# EAGLE schematic Moonwalker (EAGLE 6.3)

## Sheet 1 of 5
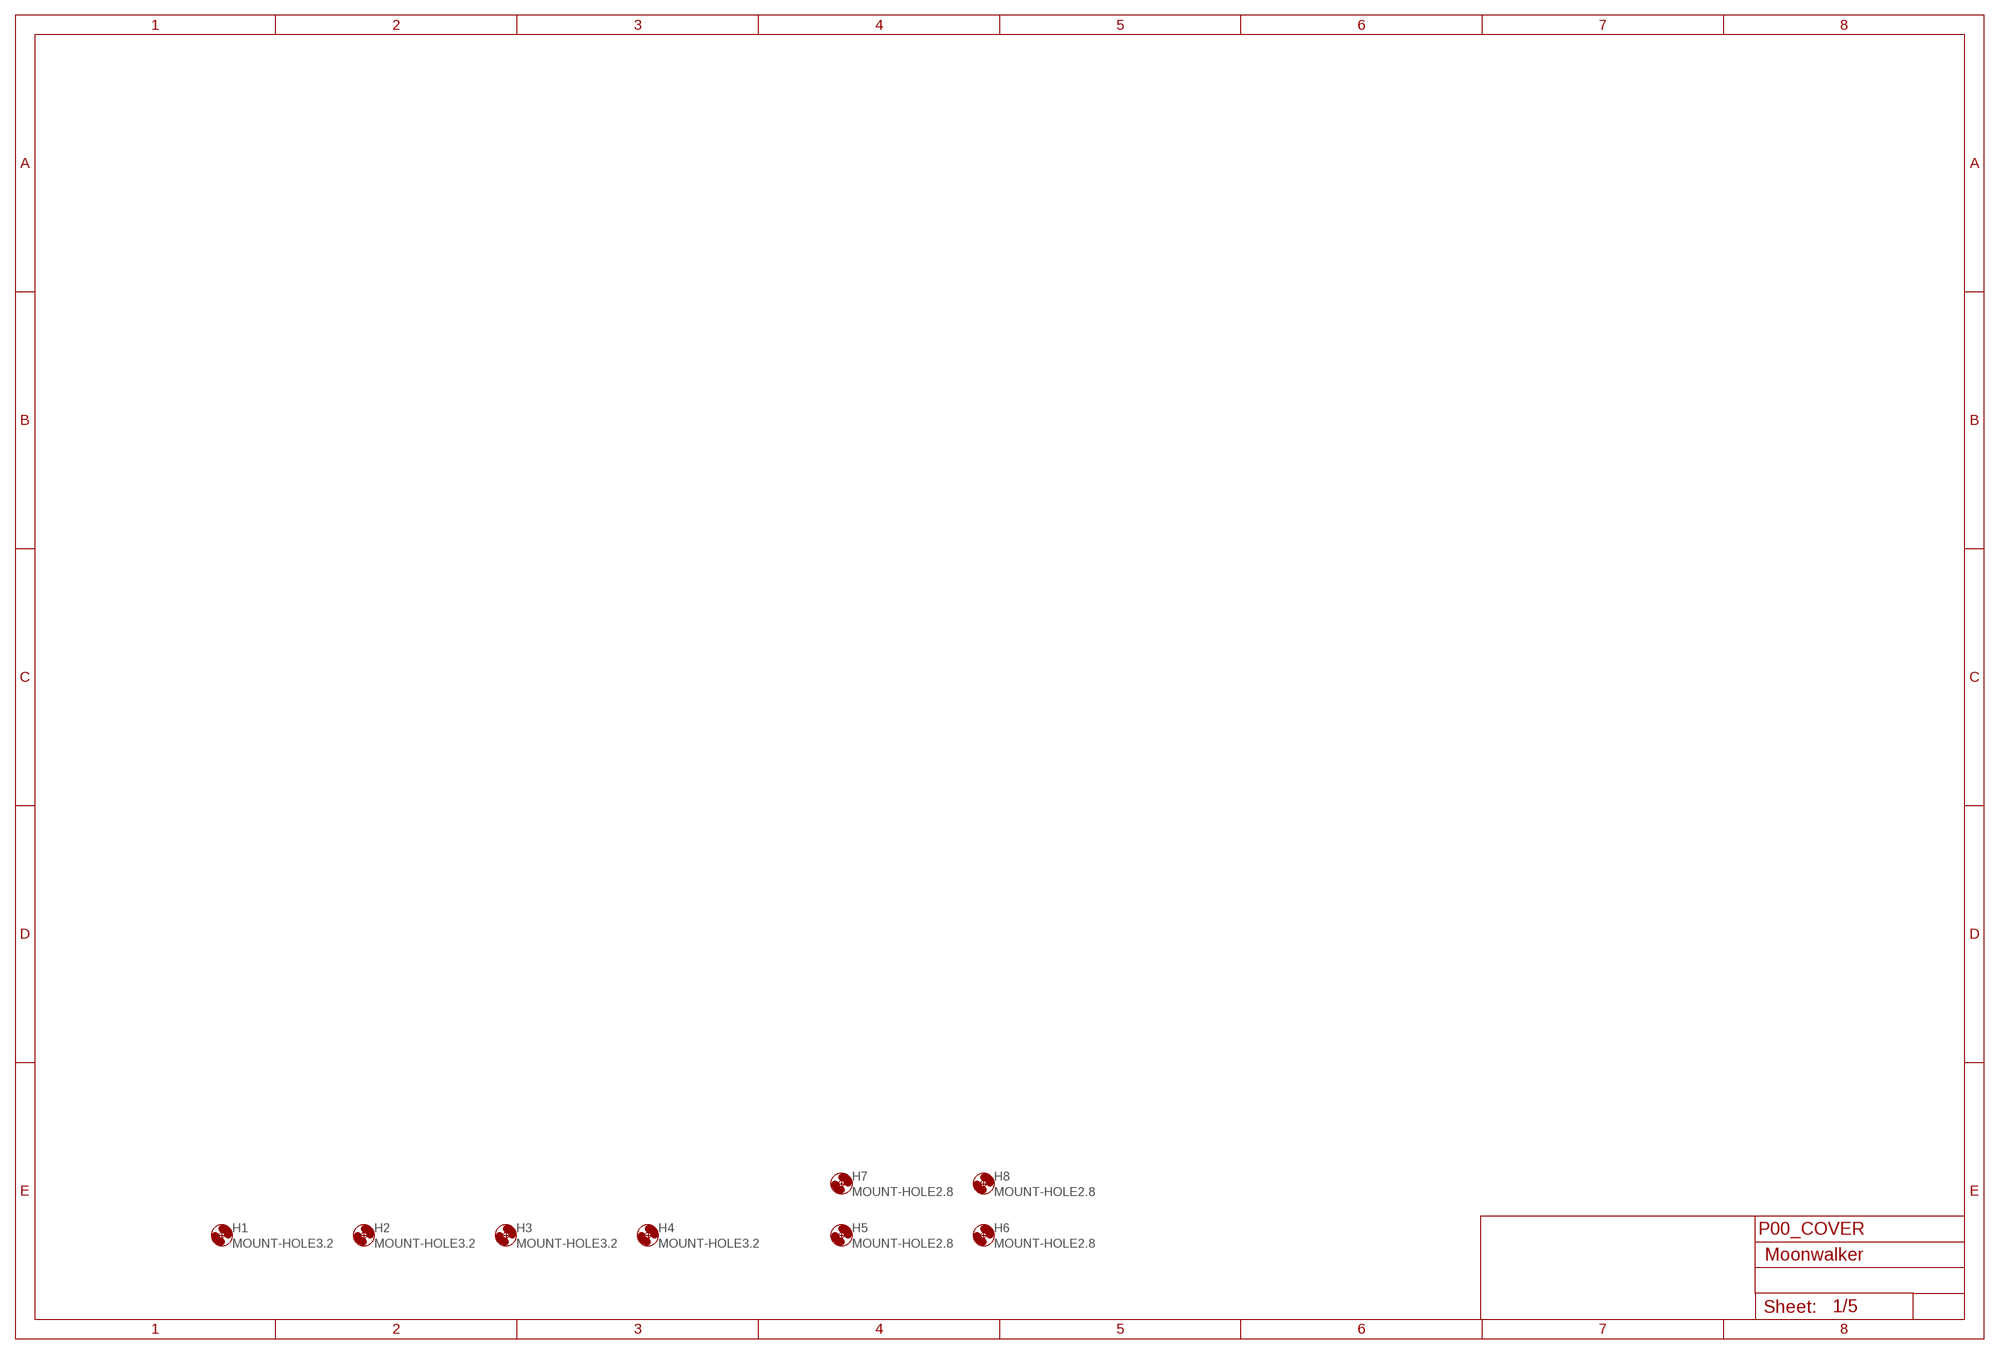
[diagram p0: schematic, sheet 1]

### Parts
H1  MOUNT-HOLE3.2  [3,2]
H2  MOUNT-HOLE3.2  [3,2]
H3  MOUNT-HOLE3.2  [3,2]
H4  MOUNT-HOLE3.2  [3,2]
H5  MOUNT-HOLE2.8  [2,8]
H6  MOUNT-HOLE2.8  [2,8]
H7  MOUNT-HOLE2.8  [2,8]
H8  MOUNT-HOLE2.8  [2,8]

### Notes on the sheet
- P00_COVER

## Sheet 2 of 5
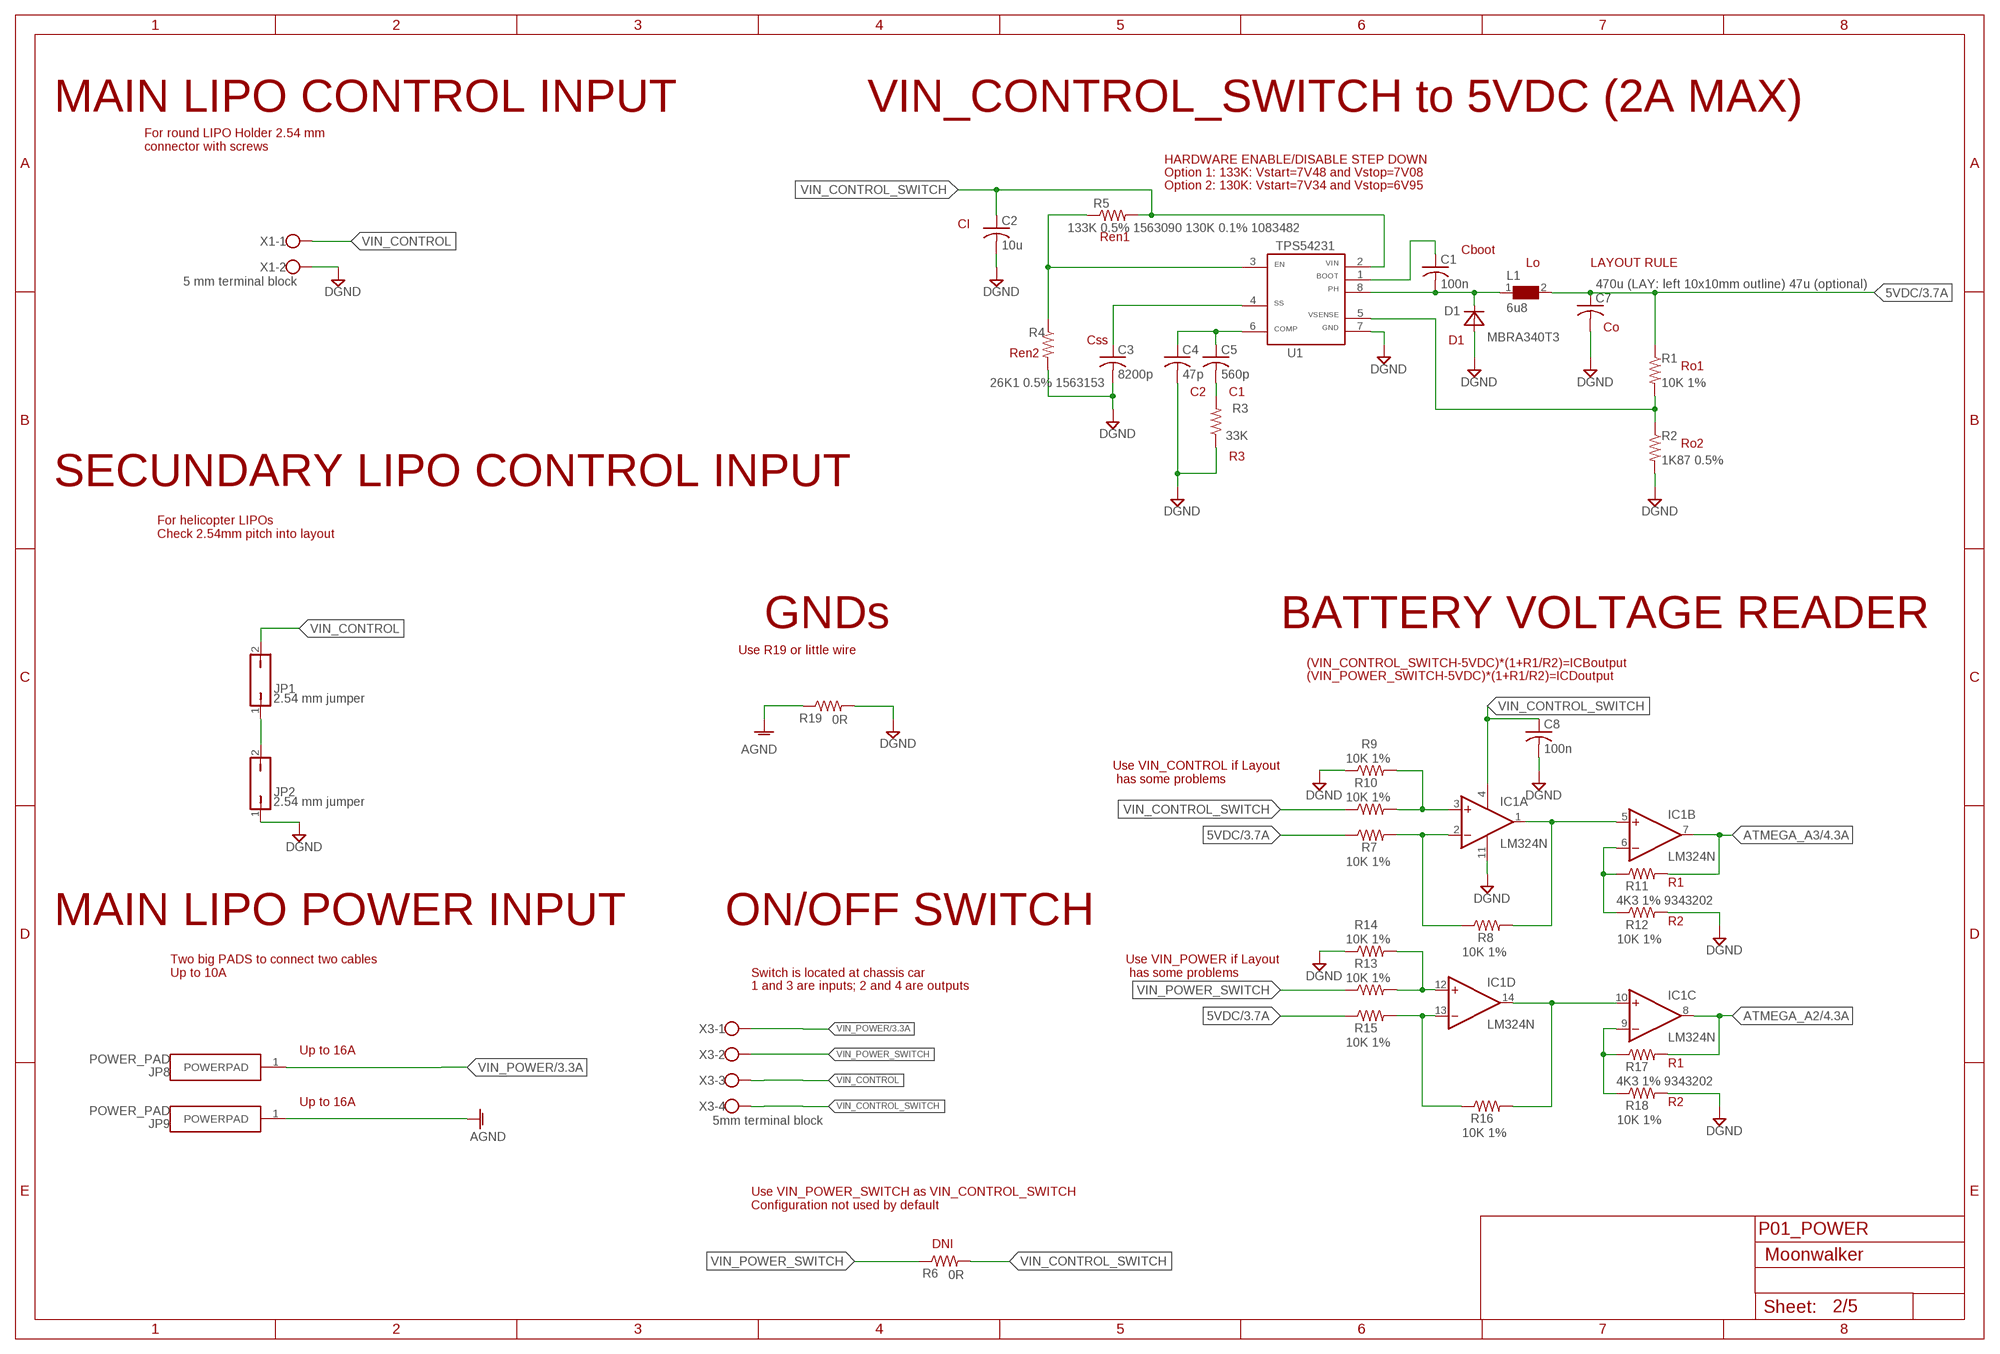
[diagram p1: schematic, sheet 2]

### Parts
C1  100n  C-US075-032X103  [C075-032X103]
C2  10u  C-US025-050X050  [C025-050X050]
C3  8200p  C-USC1206  [C1206]
C4  47p  C-US050-024X044  [C050-024X044]
C5  560p  C-USC1206  [C1206]
C7  470u (LAY: left 10x10mm outline) 47u (optional)  C-US050-075X075  [C050-075X075]
C8  100n  C-US050-024X044  [C050-024X044]
D1  MBRA340T3  [SMA]
IC1  LM324N  [DIL14]
JP1  2.54 mm jumper  JP1Q  [JP1]
JP2  2.54 mm jumper  JP1Q  [JP1]
JP8  POWER_PAD  [POWER_PAD]
JP9  POWER_PAD  [POWER_PAD]
L1  6u8  WE-PD-7447779006_7332/7345_PLASTIC_BASE  [WE-PD_7332/7345_PLASTIC_BASE]
R1  10K 1%  R-US_0309/10  [0309/10]
R2  1K87 0.5%  R-US_0309/10  [0309/10]
R3  33K  R-US_0309/10  [0309/10]
R4  26K1 0.5% 1563153  R-US_0309/10  [0309/10]
R5  133K 0.5% 1563090 130K 0.1% 1083482  R-US_0309/10  [0309/10]
R6  0R  R-US_0309/10  [0309/10]
R7  10K 1%  R-US_0309/10  [0309/10]
R8  10K 1%  R-US_0309/10  [0309/10]
R9  10K 1%  R-US_0309/10  [0309/10]
R10  10K 1%  R-US_0309/10  [0309/10]
R11  4K3 1% 9343202  R-US_0309/10  [0309/10]
R12  10K 1%  R-US_0309/10  [0309/10]
R13  10K 1%  R-US_0309/10  [0309/10]
R14  10K 1%  R-US_0309/10  [0309/10]
R15  10K 1%  R-US_0309/10  [0309/10]
R16  10K 1%  R-US_0309/10  [0309/10]
R17  4K3 1% 9343202  R-US_0309/10  [0309/10]
R18  10K 1%  R-US_0309/10  [0309/10]
R19  0R  R-US_0309/10  [0309/10]
U1  TPS54231SO8  [SO8]
X1  5 mm terminal block  W237-102  [W237-102]
X3  5mm terminal block  W237-4  [W237-4]

### Nets
5VDC: C7.1 L1.2 R1.1 R7.1 R15.1 ; also sheet 3,4,5
AGND: JP9.1(POWERPAD) R19.1 ; also sheet 3
ATMEGA_A2: IC1.8(C:OUT) R17.2 ; also sheet 4
ATMEGA_A3: IC1.7(B:OUT) R11.2 ; also sheet 4
DGND: C2.2 C3.2 C4.2 C7.2 C8.2 D1.A IC1.11(P:V-) JP2.1 R2.2 R3.1 R4.2 R9.1 R12.2 R14.1 R18.2 R19.2 U1.7 X1.2 ; also sheet 3,4,5
N$1: C4.1 C5.1 U1.6
N$2: C5.2 R3.2
N$3: R4.1 R5.1 U1.3
N$4: C3.1 U1.4
N$7: C1.2 D1.C L1.1 U1.8
N$8: C1.1 U1.1
N$9: R1.2 R2.1 U1.5
N$10: JP1.1 JP2.2
N$13: IC1.3(A:+IN) R9.2 R10.2
N$14: IC1.2(A:-IN) R7.2 R8.1
N$15: IC1.12(D:+IN) R13.2 R14.2
N$16: IC1.13(D:-IN) R15.2 R16.1
N$17: IC1.10(C:+IN) IC1.14(D:OUT) R16.2
N$18: IC1.1(A:OUT) IC1.5(B:+IN) R8.2
N$22: IC1.6(B:-IN) R11.1 R12.1
N$24: IC1.9(C:-IN) R17.1 R18.1
VIN_CONTROL: JP1.2 X1.1 X3.3
VIN_CONTROL_SWITCH: C2.1 C8.1 IC1.4(P:V+) R5.2 R6.2 R10.1 U1.2 X3.4
VIN_POWER: JP8.1(POWERPAD) X3.1 ; also sheet 3
VIN_POWER_SWITCH: R6.1 R13.1 X3.2

### Notes on the sheet
- MAIN LIPO CONTROL INPUT | VIN_CONTROL_SWITCH to 5VDC (2A MAX)
- For round LIPO Holder 2.54 mm 
  connector with screws
- HARDWARE ENABLE/DISABLE STEP DOWN
- Option 1: 133K: Vstart=7V48 and Vstop=7V08
- Option 2: 130K: Vstart=7V34 and Vstop=6V95
- CI
- Ren1
- Cboot
- Lo | LAYOUT RULE
- Co
- Css | D1
- Ren2
- Ro1
- C2 | C1
- Ro2
- R3
- SECUNDARY LIPO CONTROL INPUT
- For helicopter LIPOs
  Check 2.54mm pitch into layout
- GNDs | BATTERY VOLTAGE READER
- Use R19 or little wire
- (VIN_CONTROL_SWITCH-5VDC)*(1+R1/R2)=ICBoutput
- (VIN_POWER_SWITCH-5VDC)*(1+R1/R2)=ICDoutput
- Use VIN_CONTROL if Layout
   has some problems
- R1
- MAIN LIPO POWER INPUT | ON/OFF SWITCH | R2
- Two big PADS to connect two cables
  Up to 10A
- Switch is located at chassis car
- Use VIN_POWER if Layout
   has some problems
- 1 and 3 are inputs; 2 and 4 are outputs
- Up to 16A
- R1
- Up to 16A | R2
- Use VIN_POWER_SWITCH as VIN_CONTROL_SWITCH
  Configuration not used by default
- P01_POWER
- DNI

## Sheet 3 of 5
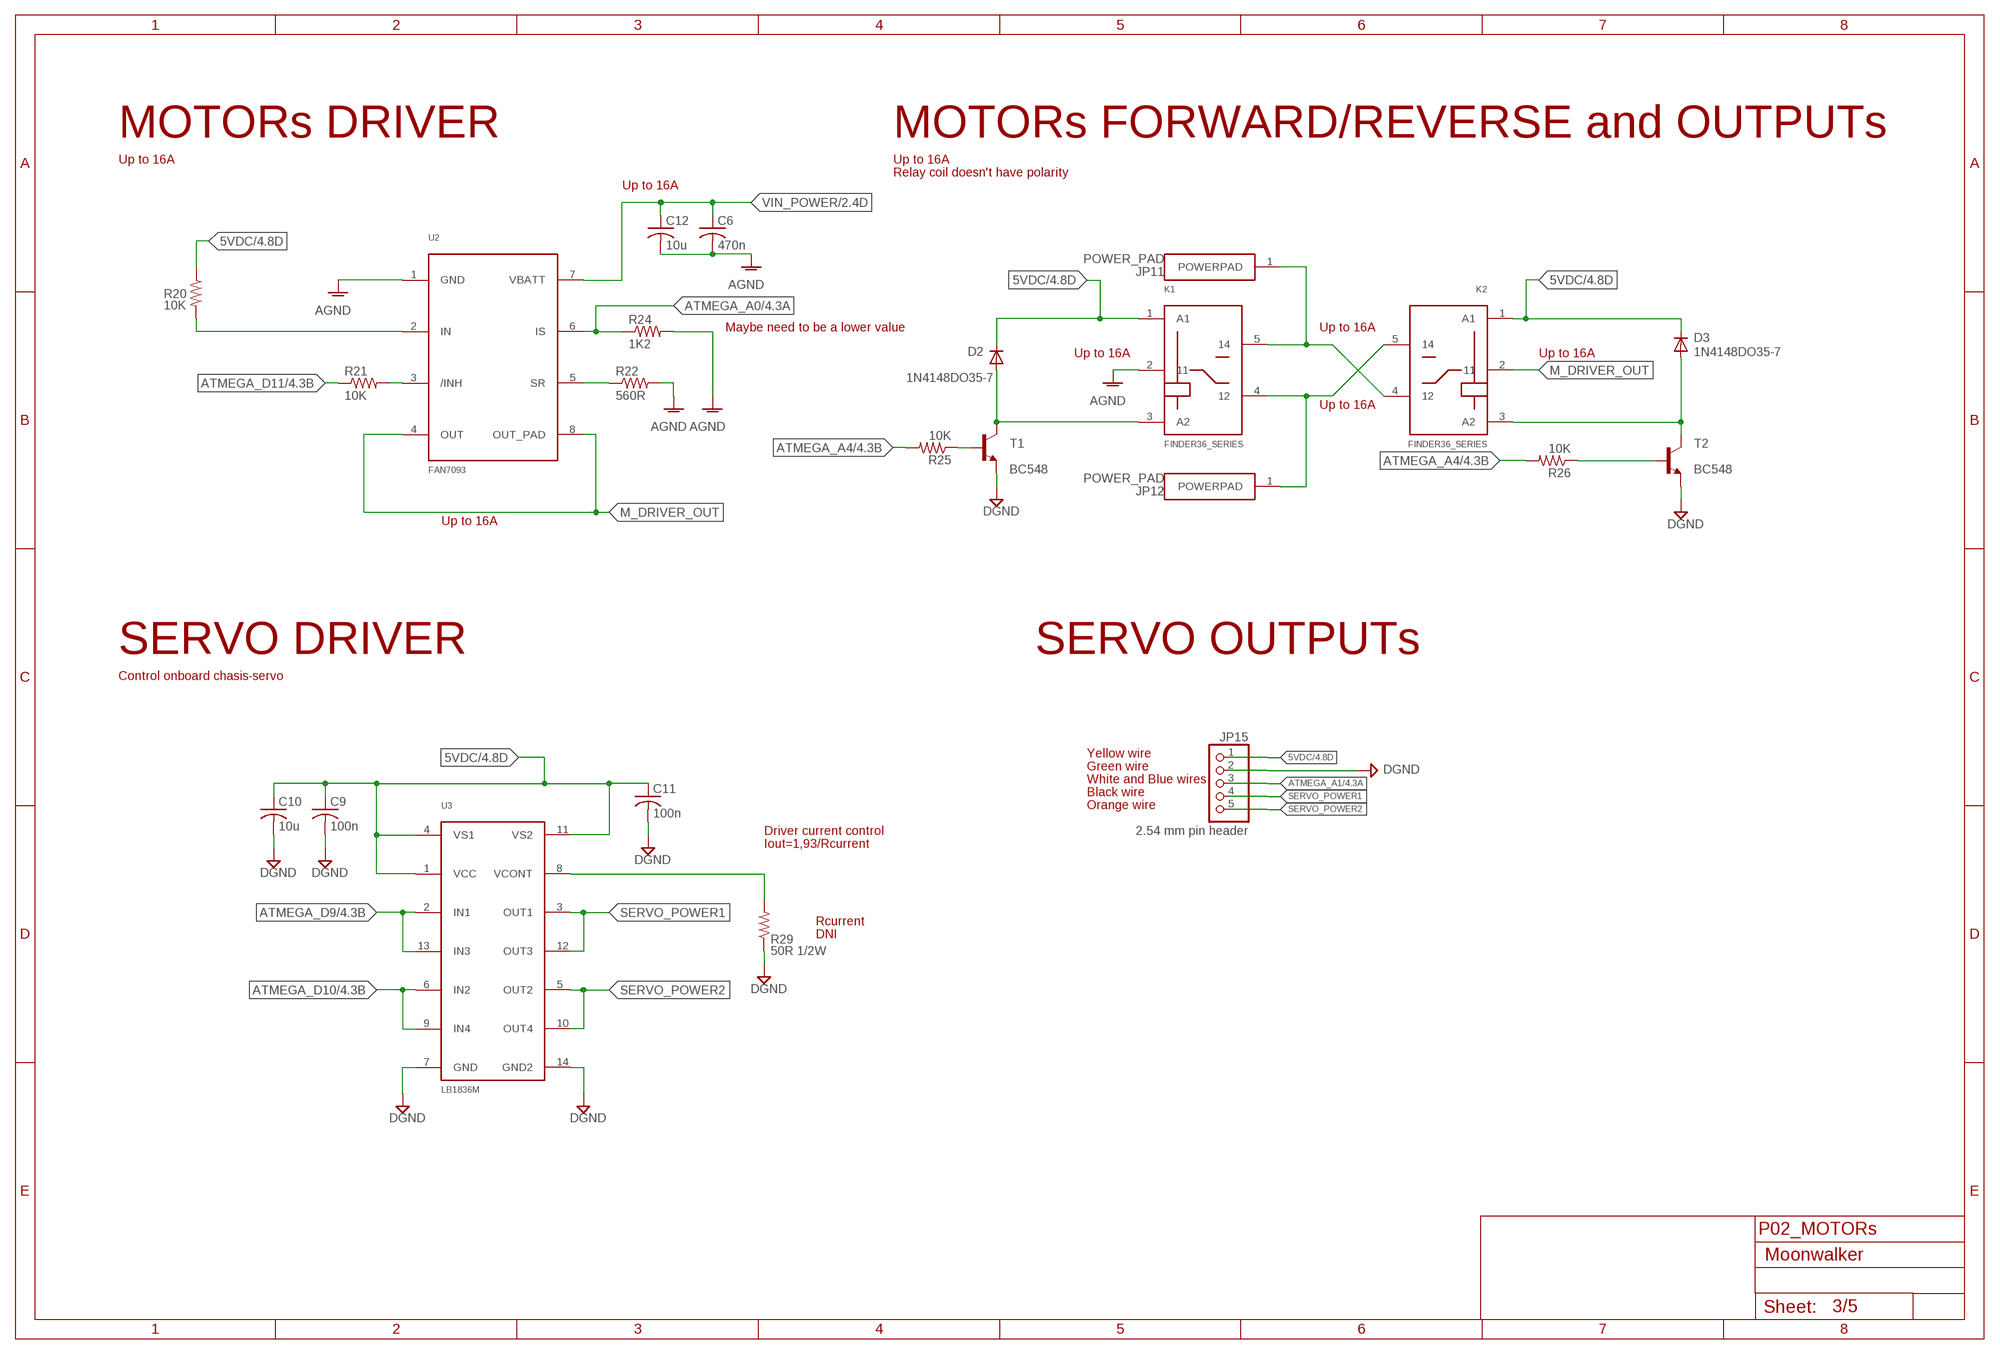
[diagram p2: schematic, sheet 3]

### Parts
C6  470n  C-US050-050X075  [C050-050X075]
C9  100n  C-US050-024X044  [C050-024X044]
C10  10u  C-US025-050X050  [C025-050X050]
C11  100n  C-US050-024X044  [C050-024X044]
C12  10u  C-US025-050X050  [C025-050X050]
D2  1N4148DO35-7  [DO35-7]
D3  1N4148DO35-7  [DO35-7]
JP11  POWER_PAD  [POWER_PAD]
JP12  POWER_PAD  [POWER_PAD]
JP15  2.54 mm pin header  PINHD-1X5/90  [1X05/90]
K1  FINDER36_SERIES  [FINDERSERIE36]
K2  FINDER36_SERIES  [FINDERSERIE36]
R20  10K  R-US_0309/10  [0309/10]
R21  10K  R-US_0309/10  [0309/10]
R22  560R  R-US_0309/10  [0309/10]
R24  1K2  R-US_0411/12  [0411/12]
R25  10K  R-US_0309/10  [0309/10]
R26  10K  R-US_0309/10  [0309/10]
R29  50R 1/2W  R-US_0411/12  [0411/12]
T1  BC548  BC548-NPN-TO92-CBE  [TO92-CBE]
T2  BC548  BC548-NPN-TO92-CBE  [TO92-CBE]
U2  FAN7093  [TO263]
U3  LB1836M  [SOIC14W]

### Nets
5VDC: C9.1 C10.1 C11.1 D2.C D3.C JP15.1 K1.1(A1) K2.1(A1) R20.1 U3.1(VCC) U3.4(VS1) U3.11(VS2) ; also sheet 2,4,5
AGND: C6.2 C12.2 K1.2 R22.2 R24.2 U2.1(GND) ; also sheet 2
ATMEGA_A0: R24.1 U2.6(IS) ; also sheet 4
ATMEGA_A1: JP15.3 ; also sheet 4
ATMEGA_A4: R25.2 R26.2 ; also sheet 4
ATMEGA_D9: U3.2(IN1) U3.13(IN3) ; also sheet 4
ATMEGA_D10: U3.6(IN2) U3.9(IN4) ; also sheet 4
ATMEGA_D11: R21.1 ; also sheet 4
DGND: C9.2 C10.2 C11.2 JP15.2 R29.1 T1.E T2.E U3.7(GND) U3.14(GND2) ; also sheet 2,4,5
M_DRIVER_OUT: K2.2 U2.4(OUT) U2.8(OUT_PAD)
N$6: R29.2 U3.8(VCONT)
N$23: JP11.1(POWERPAD) K1.5 K2.4
N$25: R22.1 U2.5(SR)
N$26: R20.2 U2.2(IN)
N$27: R21.2 U2.3(/INH)
N$33: JP12.1(POWERPAD) K1.4 K2.5
N$34: D2.A K1.3(A2) T1.C
N$37: D3.A K2.3(A2) T2.C
N$38: R26.1 T2.B
N$39: R25.1 T1.B
SERVO_POWER1: JP15.4 U3.3(OUT1) U3.12(OUT3)
SERVO_POWER2: JP15.5 U3.5(OUT2) U3.10(OUT4)
VIN_POWER: C6.1 C12.1 U2.7(VBATT) ; also sheet 2

### Notes on the sheet
- MOTORs DRIVER | MOTORs FORWARD/REVERSE and OUTPUTs
- Up to 16A | Up to 16A
- Relay coil doesn't have polarity
- Up to 16A
- Maybe need to be a lower value | Up to 16A
- Up to 16A | Up to 16A
- Up to 16A
- Up to 16A
- SERVO DRIVER | SERVO OUTPUTs
- Control onboard chasis-servo
- Yellow wire
- Green wire
- White and Blue wires
- Black wire
- Orange wire
- Driver current control
- Iout=1,93/Rcurrent
- Rcurrent
- DNI
- P02_MOTORs

## Sheet 4 of 5
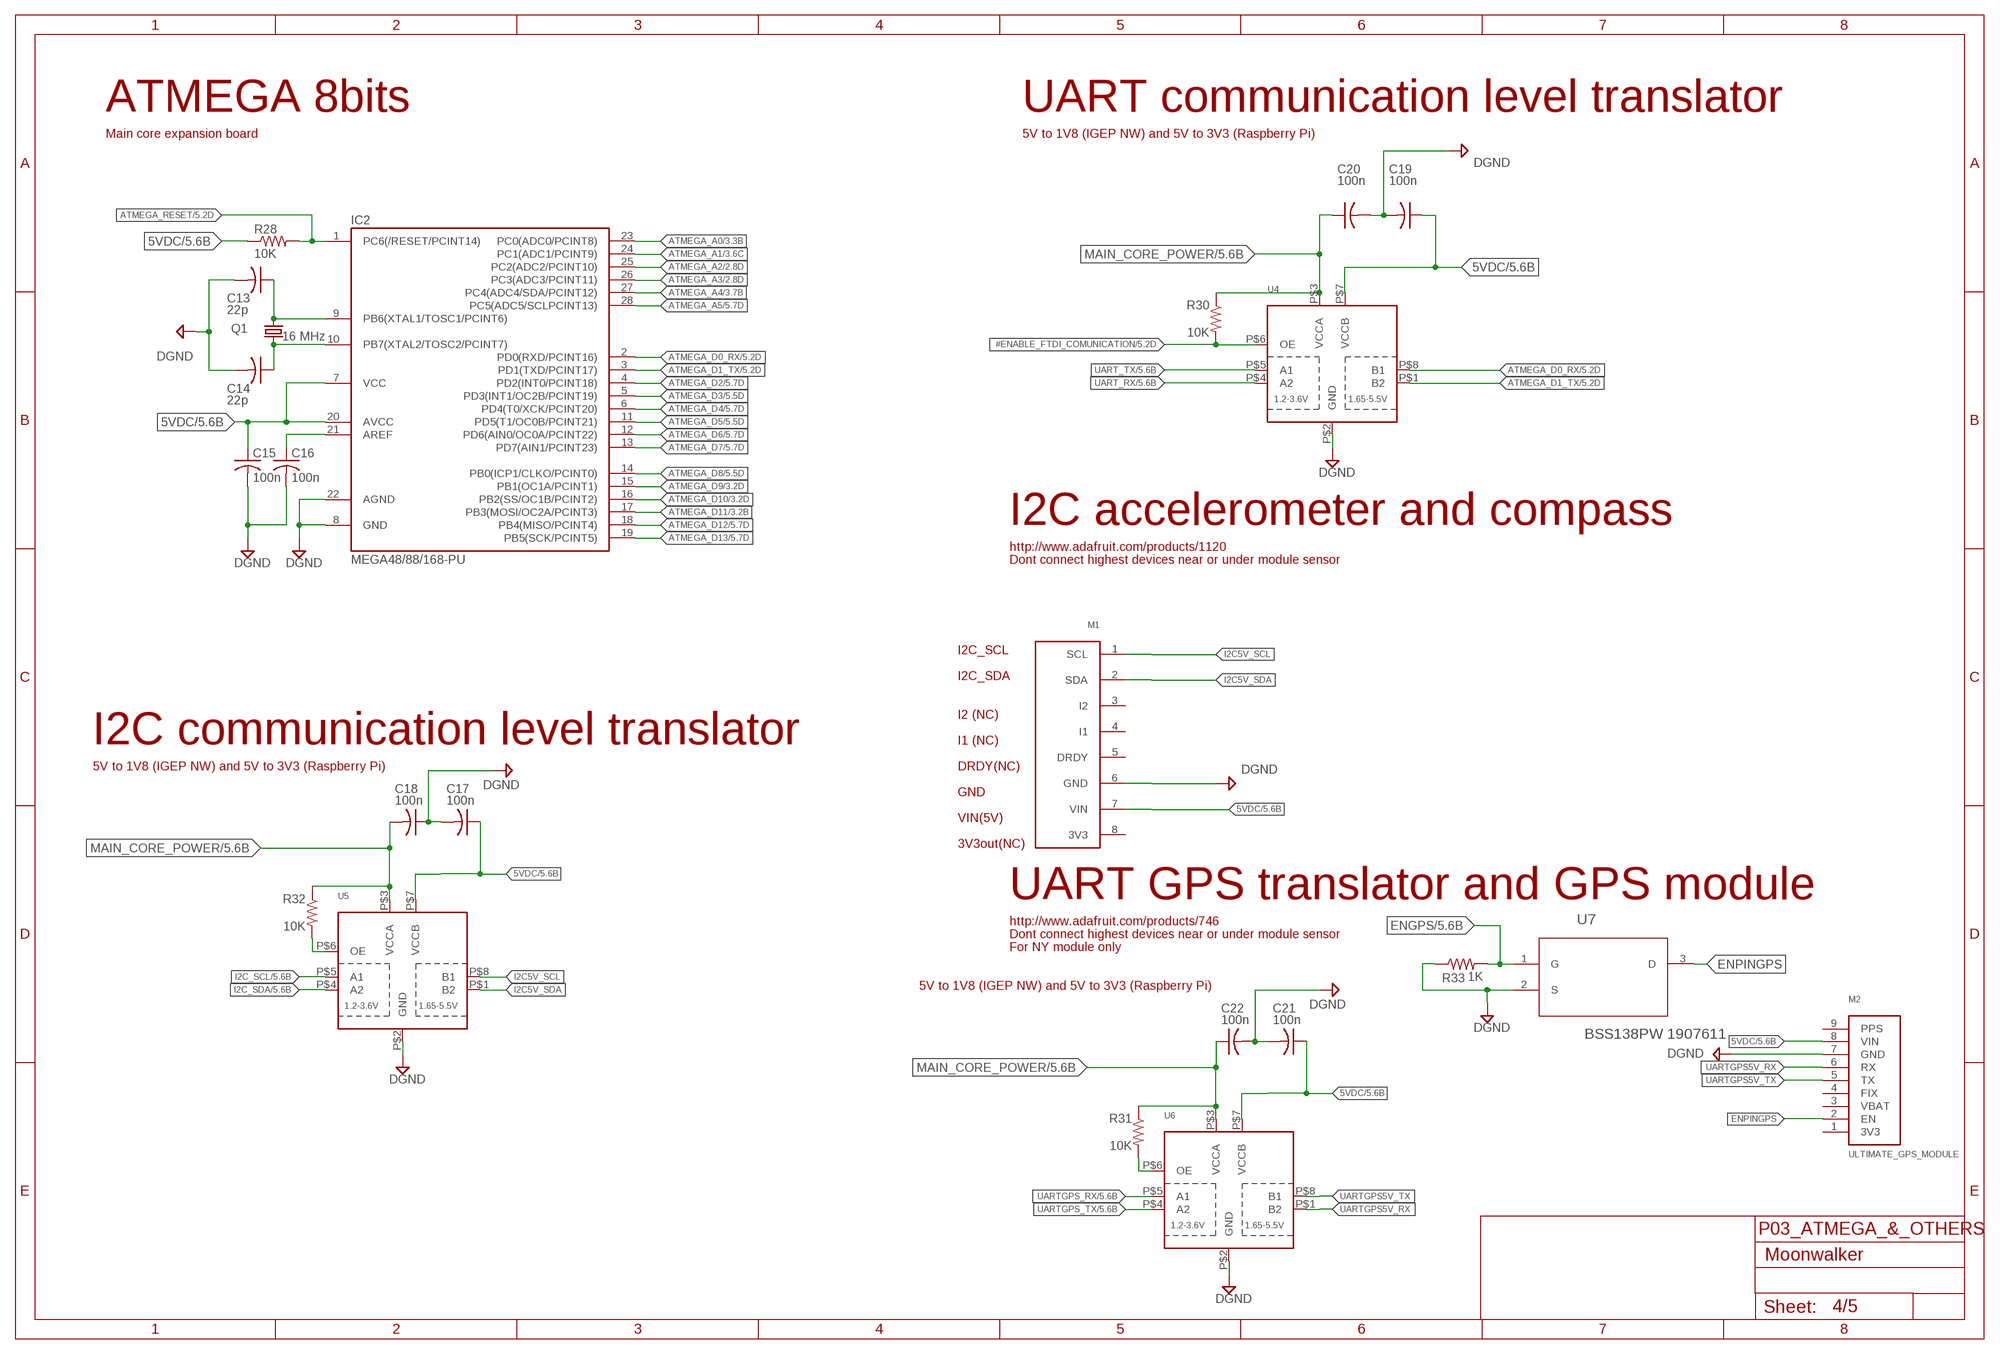
[diagram p3: schematic, sheet 4]

### Parts
C13  22p  C-US050-024X044  [C050-024X044]
C14  22p  C-US050-024X044  [C050-024X044]
C15  100n  C-US050-024X044  [C050-024X044]
C16  100n  C-US050-024X044  [C050-024X044]
C17  100n  C-US050-024X044  [C050-024X044]
C18  100n  C-US050-024X044  [C050-024X044]
C19  100n  C-US050-024X044  [C050-024X044]
C20  100n  C-US050-024X044  [C050-024X044]
C21  100n  C-US050-024X044  [C050-024X044]
C22  100n  C-US050-024X044  [C050-024X044]
IC2  MEGA48/88/168-PU  [DIL28-3]
M1  COMPASS_&_ACCELEROMETER_ADAFRUIT_LSM303  [COMPASS_&_ACCELEROMETER_ADAFRUIT_LSM303]
M2  ULTIMATE_GPS_MODULE  [ULTIMATE_GPS_MODULE]
Q1  16 MHz  CRYSTALHC49S  [HC49/S]
R28  10K  R-US_0309/10  [0309/10]
R30  10K  R-US_0309/10  [0309/10]
R31  10K  R-US_0309/10  [0309/10]
R32  10K  R-US_0309/10  [0309/10]
R33  1K  R-US_0309/10  [0309/10]
U4  TXS0102  [VFSOP-8]
U5  TXS0102  [VFSOP-8]
U6  TXS0102  [VFSOP-8]
U7  BSS138PW 1907611  BSS138BKW  [SOT65P210X110-3N]

### Nets
5VDC: C15.1 C17.1 C19.1 C21.1 IC2.7(VCC) IC2.20(AVCC) M1.7(VIN) M2.8(VIN) R28.1 U4.P$7(VCCB) U5.P$7(VCCB) U6.P$7(VCCB) ; also sheet 2,3,5
#ENABLE_FTDI_COMUNICATION: R30.2 U4.P$6(OE) ; also sheet 5
ATMEGA_A0: IC2.23(PC0(ADC0/PCINT8)) ; also sheet 3
ATMEGA_A1: IC2.24(PC1(ADC1/PCINT9)) ; also sheet 3
ATMEGA_A2: IC2.25(PC2(ADC2/PCINT10)) ; also sheet 2
ATMEGA_A3: IC2.26(PC3(ADC3/PCINT11)) ; also sheet 2
ATMEGA_A4: IC2.27(PC4(ADC4/SDA/PCINT12)) ; also sheet 3
ATMEGA_A5: IC2.28(PC5(ADC5/SCLPCINT13)) ; also sheet 5
ATMEGA_D0_RX: IC2.2(PD0(RXD/PCINT16)) U4.P$8(B1) ; also sheet 5
ATMEGA_D1_TX: IC2.3(PD1(TXD/PCINT17)) U4.P$1(B2) ; also sheet 5
ATMEGA_D2: IC2.4(PD2(INT0/PCINT18)) ; also sheet 5
ATMEGA_D3: IC2.5(PD3(INT1/OC2B/PCINT19)) ; also sheet 5
ATMEGA_D4: IC2.6(PD4(T0/XCK/PCINT20)) ; also sheet 5
ATMEGA_D5: IC2.11(PD5(T1/OC0B/PCINT21)) ; also sheet 5
ATMEGA_D6: IC2.12(PD6(AIN0/OC0A/PCINT22)) ; also sheet 5
ATMEGA_D7: IC2.13(PD7(AIN1/PCINT23)) ; also sheet 5
ATMEGA_D8: IC2.14(PB0(ICP1/CLKO/PCINT0)) ; also sheet 5
ATMEGA_D9: IC2.15(PB1(OC1A/PCINT1)) ; also sheet 3
ATMEGA_D10: IC2.16(PB2(SS/OC1B/PCINT2)) ; also sheet 3
ATMEGA_D11: IC2.17(PB3(MOSI/OC2A/PCINT3)) ; also sheet 3
ATMEGA_D12: IC2.18(PB4(MISO/PCINT4)) ; also sheet 5
ATMEGA_D13: IC2.19(PB5(SCK/PCINT5)) ; also sheet 5
ATMEGA_RESET: IC2.1(PC6(/RESET/PCINT14)) R28.2 ; also sheet 5
DGND: C13.2 C14.2 C15.2 C16.2 C17.2 C18.1 C19.2 C20.2 C21.2 C22.2 IC2.8(GND) IC2.22(AGND) M1.6(GND) M2.7(GND) R33.1 U4.P$2(GND) U5.P$2(GND) U6.P$2(GND) U7.2(S) ; also sheet 2,3,5
ENGPS: R33.2 U7.1(G) ; also sheet 5
ENPINGPS: M2.2(EN) U7.3(D)
I2C5V_SCL: M1.1(SCL) U5.P$8(B1)
I2C5V_SDA: M1.2(SDA) U5.P$1(B2)
I2C_SCL: U5.P$5(A1) ; also sheet 5
I2C_SDA: U5.P$4(A2) ; also sheet 5
MAIN_CORE_POWER: C18.2 C20.1 C22.1 R30.1 R31.1 R32.1 U4.P$3(VCCA) U5.P$3(VCCA) U6.P$3(VCCA) ; also sheet 5
N$11: C13.1 IC2.9(PB6(XTAL1/TOSC1/PCINT6)) Q1.2
N$12: C14.1 IC2.10(PB7(XTAL2/TOSC2/PCINT7)) Q1.1
N$20: C16.1 IC2.21(AREF)
N$40: R32.2 U5.P$6(OE)
N$47: R31.2 U6.P$6(OE)
UART_RX: U4.P$4(A2) ; also sheet 5
UART_TX: U4.P$5(A1) ; also sheet 5
UARTGPS5V_RX: M2.6(RX) U6.P$1(B2)
UARTGPS5V_TX: M2.5(TX) U6.P$8(B1)
UARTGPS_RX: U6.P$5(A1) ; also sheet 5
UARTGPS_TX: U6.P$4(A2) ; also sheet 5
Unconnected: M1.3(I2) M1.4(I1) M1.5(DRDY) M1.8(3V3) M2.1(3V3) M2.3(VBAT) M2.4(FIX) M2.9(PPS)

### Notes on the sheet
- ATMEGA 8bits | UART communication level translator
- Main core expansion board | 5V to 1V8 (IGEP NW) and 5V to 3V3 (Raspberry Pi)
- I2C accelerometer and compass
- http://www.adafruit.com/products/1120
- Dont connect highest devices near or under module sensor
- I2C_SCL
- I2C_SDA
- I2 (NC)
- I2C communication level translator | I1 (NC)
- 5V to 1V8 (IGEP NW) and 5V to 3V3 (Raspberry Pi) | DRDY(NC)
- GND
- VIN(5V)
- 3V3out(NC)
- UART GPS translator and GPS module
- http://www.adafruit.com/products/746
- Dont connect highest devices near or under module sensor
- For NY module only
- 5V to 1V8 (IGEP NW) and 5V to 3V3 (Raspberry Pi)
- P03_ATMEGA_&_OTHERS

## Sheet 5 of 5
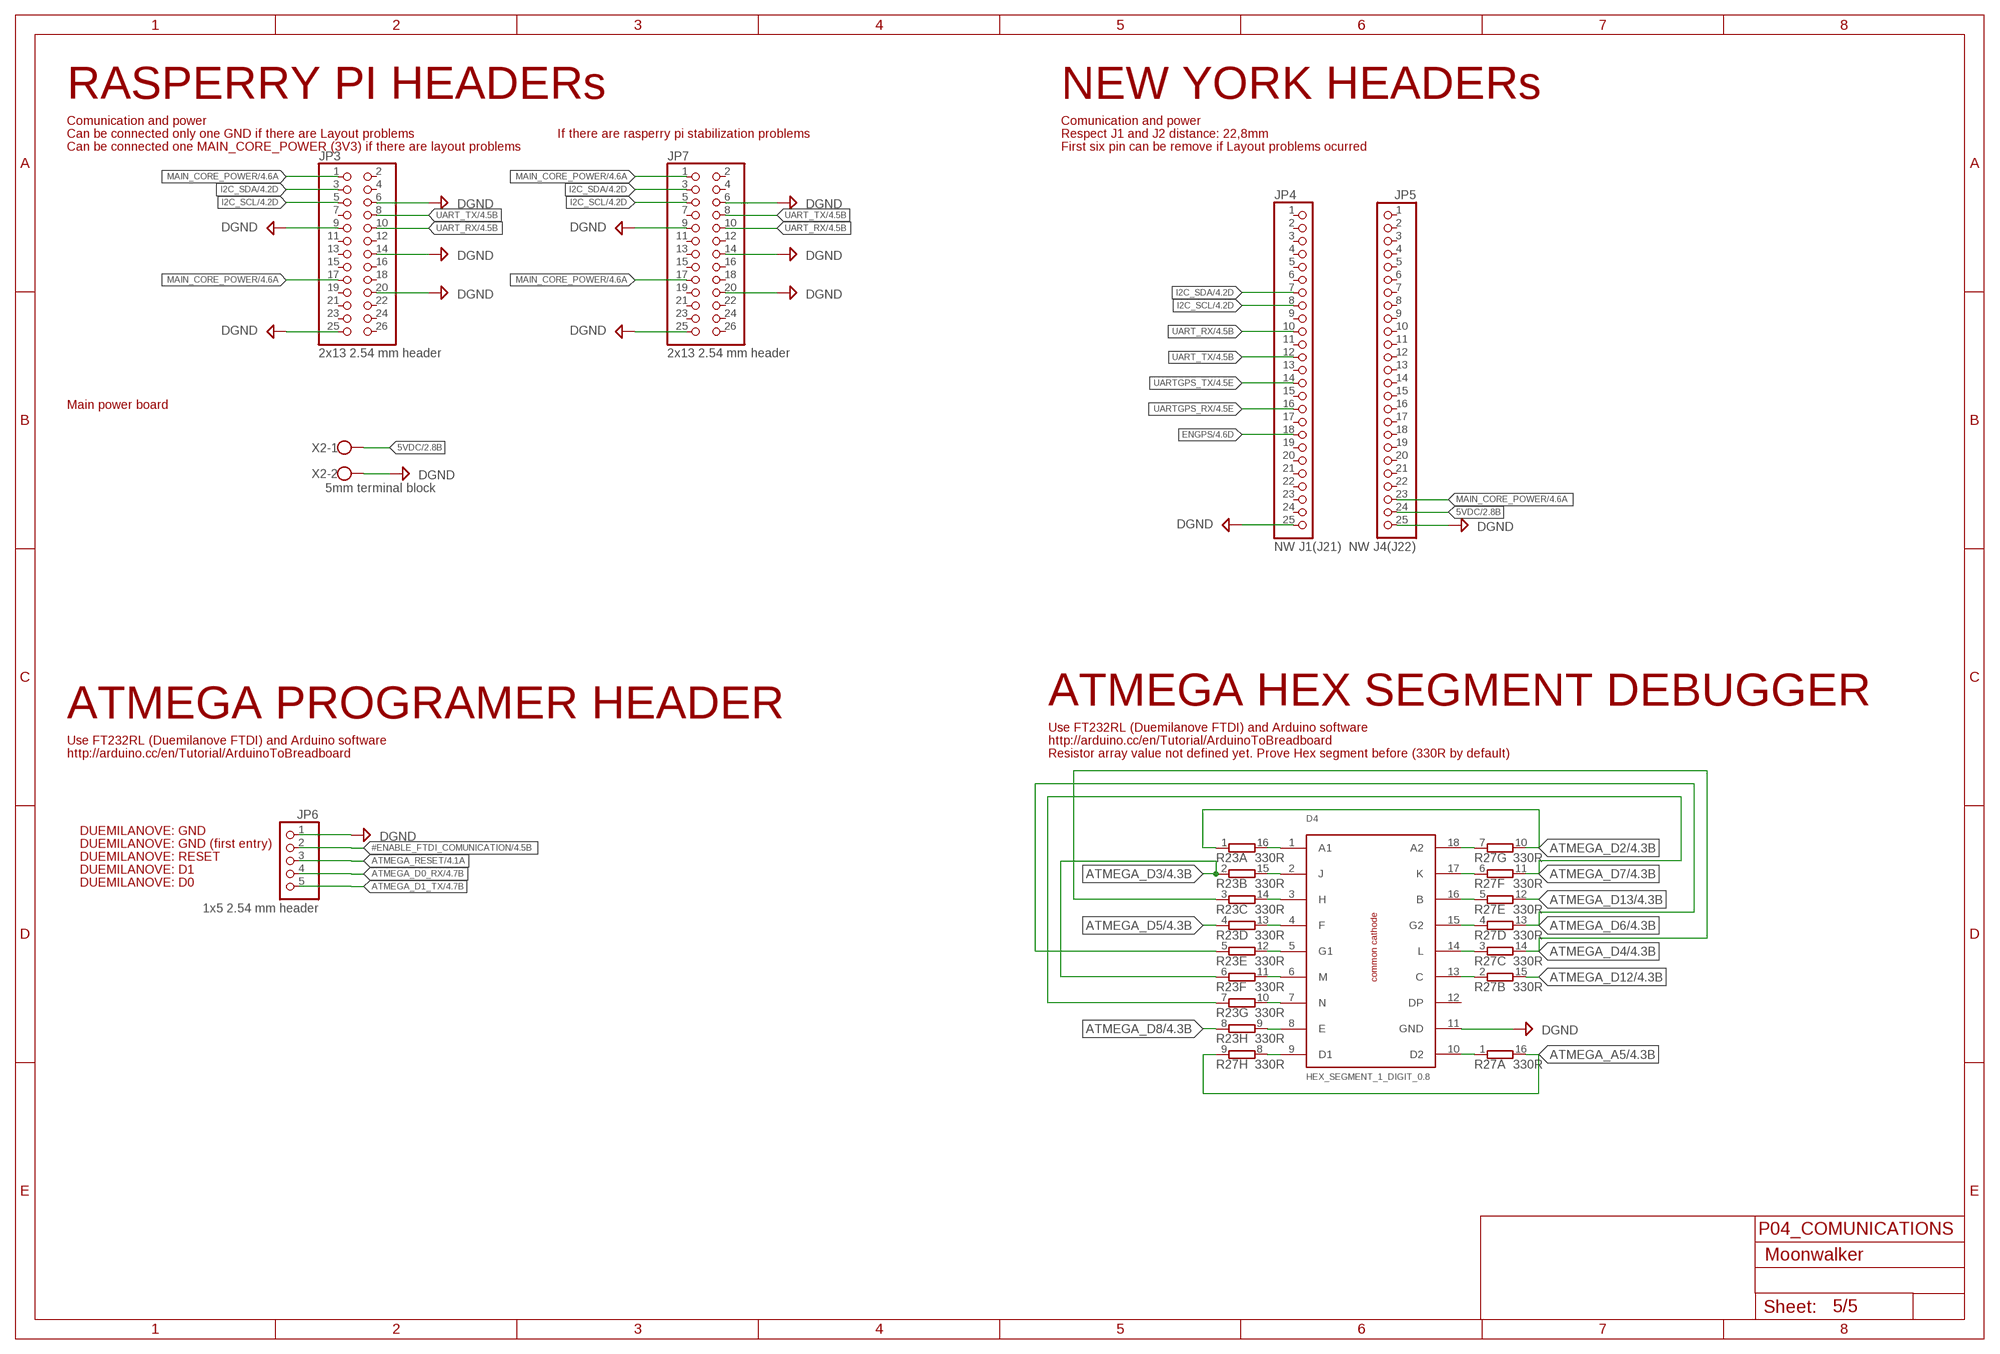
[diagram p4: schematic, sheet 5]

### Parts
D4  HEX_SEGMENT_1_DIGIT_0.8  [HEX_SEGMENT_1_DIGIT_0.8]
JP3  2x13 2.54 mm header  PINHD-2X13  [2X13]
JP4  NW J1(J21)  PINHD-1X25  [1X25]
JP5  NW J4(J22)  PINHD-1X25  [1X25]
JP6  1x5 2.54 mm header  PINHD-1X5/90  [1X05/90]
JP7  2x13 2.54 mm header  PINHD-2X13  [2X13]
R23  330R  4816P-T01E  [4816P]
R27  330R  4816P-T01E  [4816P]
X2  5mm terminal block  W237-102  [W237-102]

### Nets
5VDC: JP5.24 X2.1 ; also sheet 2,3,4
#ENABLE_FTDI_COMUNICATION: JP6.2 ; also sheet 4
ATMEGA_A5: R27.9 R27.16 ; also sheet 4
ATMEGA_D0_RX: JP6.4 ; also sheet 4
ATMEGA_D1_TX: JP6.5 ; also sheet 4
ATMEGA_D2: R23.1 R27.10 ; also sheet 4
ATMEGA_D3: R23.2 R23.6 ; also sheet 4
ATMEGA_D4: R23.3 R27.14 ; also sheet 4
ATMEGA_D5: R23.4 ; also sheet 4
ATMEGA_D6: R23.5 R27.13 ; also sheet 4
ATMEGA_D7: R23.7 R27.11 ; also sheet 4
ATMEGA_D8: R23.8 ; also sheet 4
ATMEGA_D12: R27.15 ; also sheet 4
ATMEGA_D13: R27.12 ; also sheet 4
ATMEGA_RESET: JP6.3 ; also sheet 4
DGND: D4.11(GND) JP3.6 JP3.9 JP3.14 JP3.20 JP3.25 JP4.25 JP5.25 JP6.1 JP7.6 JP7.9 JP7.14 JP7.20 JP7.25 X2.2 ; also sheet 2,3,4
ENGPS: JP4.18 ; also sheet 4
I2C_SCL: JP3.5 JP4.8 JP7.5 ; also sheet 4
I2C_SDA: JP3.3 JP4.7 JP7.3 ; also sheet 4
MAIN_CORE_POWER: JP3.1 JP3.17 JP5.23 JP7.1 JP7.17 ; also sheet 4
N$5: D4.9(D1) R27.8
N$19: D4.1(A1) R23.16
N$21: D4.13(C) R27.2
N$28: D4.2(J) R23.15
N$29: D4.3(H) R23.14
N$30: D4.4(F) R23.13
N$31: D4.5(G1) R23.12
N$32: D4.10(D2) R27.1
N$35: D4.6(M) R23.11
N$36: D4.7(N) R23.10
N$41: D4.8(E) R23.9
N$42: D4.18(A2) R27.7
N$43: D4.17(K) R27.6
N$44: D4.16(B) R27.5
N$45: D4.15(G2) R27.4
N$46: D4.14(L) R27.3
UART_RX: JP3.10 JP4.10 JP7.10 ; also sheet 4
UART_TX: JP3.8 JP4.12 JP7.8 ; also sheet 4
UARTGPS_RX: JP4.16 ; also sheet 4
UARTGPS_TX: JP4.14 ; also sheet 4
Unconnected: D4.12(DP) JP3.2 JP3.4 JP3.7 JP3.11 JP3.12 JP3.13 JP3.15 JP3.16 JP3.18 JP3.19 JP3.21 JP3.22 JP3.23 JP3.24 JP3.26 JP4.1 JP4.2 JP4.3 JP4.4 JP4.5 JP4.6 JP4.9 JP4.11 JP4.13 JP4.15 JP4.17 JP4.19 JP4.20 JP4.21 JP4.22 JP4.23 JP4.24 JP5.1 JP5.2 JP5.3 JP5.4 JP5.5 JP5.6 JP5.7 JP5.8 JP5.9 JP5.10 JP5.11 JP5.12 JP5.13 JP5.14 JP5.15 JP5.16 JP5.17 JP5.18 JP5.19 JP5.20 JP5.21 JP5.22 JP7.2 JP7.4 JP7.7 JP7.11 JP7.12 JP7.13 JP7.15 JP7.16 JP7.18 JP7.19 JP7.21 JP7.22 JP7.23 JP7.24 JP7.26

### Notes on the sheet
- RASPERRY PI HEADERs | NEW YORK HEADERs
- Comunication and power | Comunication and power
- Can be connected only one GND if there are Layout problems | If there are rasperry pi stabilization problems | Respect J1 and J2 distance: 22,8mm
- Can be connected one MAIN_CORE_POWER (3V3) if there are layout problems | First six pin can be remove if Layout problems ocurred
- Main power board
- ATMEGA PROGRAMER HEADER | ATMEGA HEX SEGMENT DEBUGGER
- Use FT232RL (Duemilanove FTDI) and Arduino software
- Use FT232RL (Duemilanove FTDI) and Arduino software | http://arduino.cc/en/Tutorial/ArduinoToBreadboard
- http://arduino.cc/en/Tutorial/ArduinoToBreadboard | Resistor array value not defined yet. Prove Hex segment before (330R by default)
- DUEMILANOVE: GND
- DUEMILANOVE: GND (first entry)
- DUEMILANOVE: RESET
- DUEMILANOVE: D1
- DUEMILANOVE: D0
- P04_COMUNICATIONS

## Library data of the parts
C1 = adafruit:C-US: CAPACITOR, American symbol
C2-C22 = rcl:C-US: CAPACITOR, American symbol
D1 = diode:MBRA340T3: Surface Mount Schottky Power Rectifier Source: http://www.onsemi.com/pub_link/Collateral/MBRA340T3-D.PDF
D2 D3 = diode:1N4148: DIODE high speed (Philips)
D4 = ppajuel_library:HEX_SEGMENT_1_DIGIT_0.8: http://www.adafruit.com/products/1412
H1-H8 = holes:MOUNT-HOLE: MOUNTING HOLE with drill center marker
IC1 = linear:LM324: OP AMP
IC2 = avr-7:MEGA48/88/168-PU
JP1 JP2 = jumper:JP1Q: JUMPER
JP3 JP7 = pinhead:PINHD-2X13: PIN HEADER
JP4 JP5 = pinhead:PINHD-1X25: PIN HEADER
JP6 JP15 = pinhead:PINHD-1X5: PIN HEADER
JP8 JP9 JP11 JP12 = ppajuel_library:POWER_PAD: POWER PAD
K1 K2 = ppajuel_library:FINDER36_SERIES: http://gfinder.findernet.com//assets/Series/356/S36ES.pdf
L1 = WE-PD:WE-PD: SMD-Shielded Power Inductors WE-PD - Magnetically shielded version which results in a low leakage field - High storage capacity - Low self-losses - Highest possible current loading for SMD-Inducors -- Switching regulators with low operating voltages (computer, laptop, mobile phones, pagers) -- Integrated DC/DC-converter -- Is recommended for the application with switching regulators from National Semiconductor, Linear Technology, Texas Instruments and Fairchild Semiconductor, ect. -- Graphic cards -- Plastic base: Because of the one piece construction these are more suitable for high vibration or shock applications; MPN: 7447779006; OC_FARNELL: 1635987; OC_NEWARK: 08P2857; PACKAGE: 7345; SUPPLIER: Wuerth Elektronik
M1 = ppajuel_library:COMPASS_&_ACCELEROMETER_ADAFRUIT_LSM303: http://www.adafruit.com/products/1120
M2 = ppajuel_library:ULTIMATE_GPS_MODULE: http://www.adafruit.com/products/746
Q1 = crystal:CRYSTAL: CRYSTAL; OC_FARNELL: 1667008; OC_NEWARK: unknown
R1-R22 R24-R26 R28-R33 = rcl:R-US_: RESISTOR, American symbol
R23 R27 = resistor-bourns:4816P-T01E: BOURNS RESISTOR NETWORK; OC_FARNELL: unknown; OC_NEWARK: unknown
T1 T2 = transistor:*-NPN-: NPN Transistror BF959 corrected 2008.03.06
U1 = bqevm_additional_ti_ics:TPS54231: According to: http://www.ti.com/lit/ds/symlink/tps54231.pdf
U2 = ppajuel_library:FAN7093
U3 = ppajuel_library:LB1836M: http://www.onsemi.com/pub_link/Collateral/LB1836M-D.PDF
U4-U6 = adafruit:TXS0102: 2-Bit Bi-Directional Level Shifter (I2C, etc.) Designed for I2C devices and has internal pullups. Not to be confused with TXB010x series. 1.2V-3.6V (VCCA) to 1.65V-5.5V (VCCB) bi-directional level shifter with auto direction sensing. Max data rate - 24Mbps (Push Pull), 2Mbps (Open Drain) Digikey: 296-21931-1-ND
U7 = ppajuel_library:BSS138BKW: N-channel Trench MOSFET; MPN: BSS138BKW; OC_FARNELL: 2053836; OC_NEWARK: 61T7488; PACKAGE: SOT-23-3; SUPPLIER: NXP
X1 X2 = con-wago-500:W237-102: WAGO SCREW CLAMP; MPN: 237-102; OC_FARNELL: unknown; OC_NEWARK: 70K9898
X3 = con-wago-500:W237-4: WAGO SCREW CLAMP; OC_FARNELL: unknown; OC_NEWARK: unknown